# EAGLE design Solar_v1.1 (EAGLE 5.07)
DOCUMENTNUMBER: v1.0; POWER: 1/16W; TITLE: SOLAR CHARGER; TOLERANCE: 1%; VDC: 10V
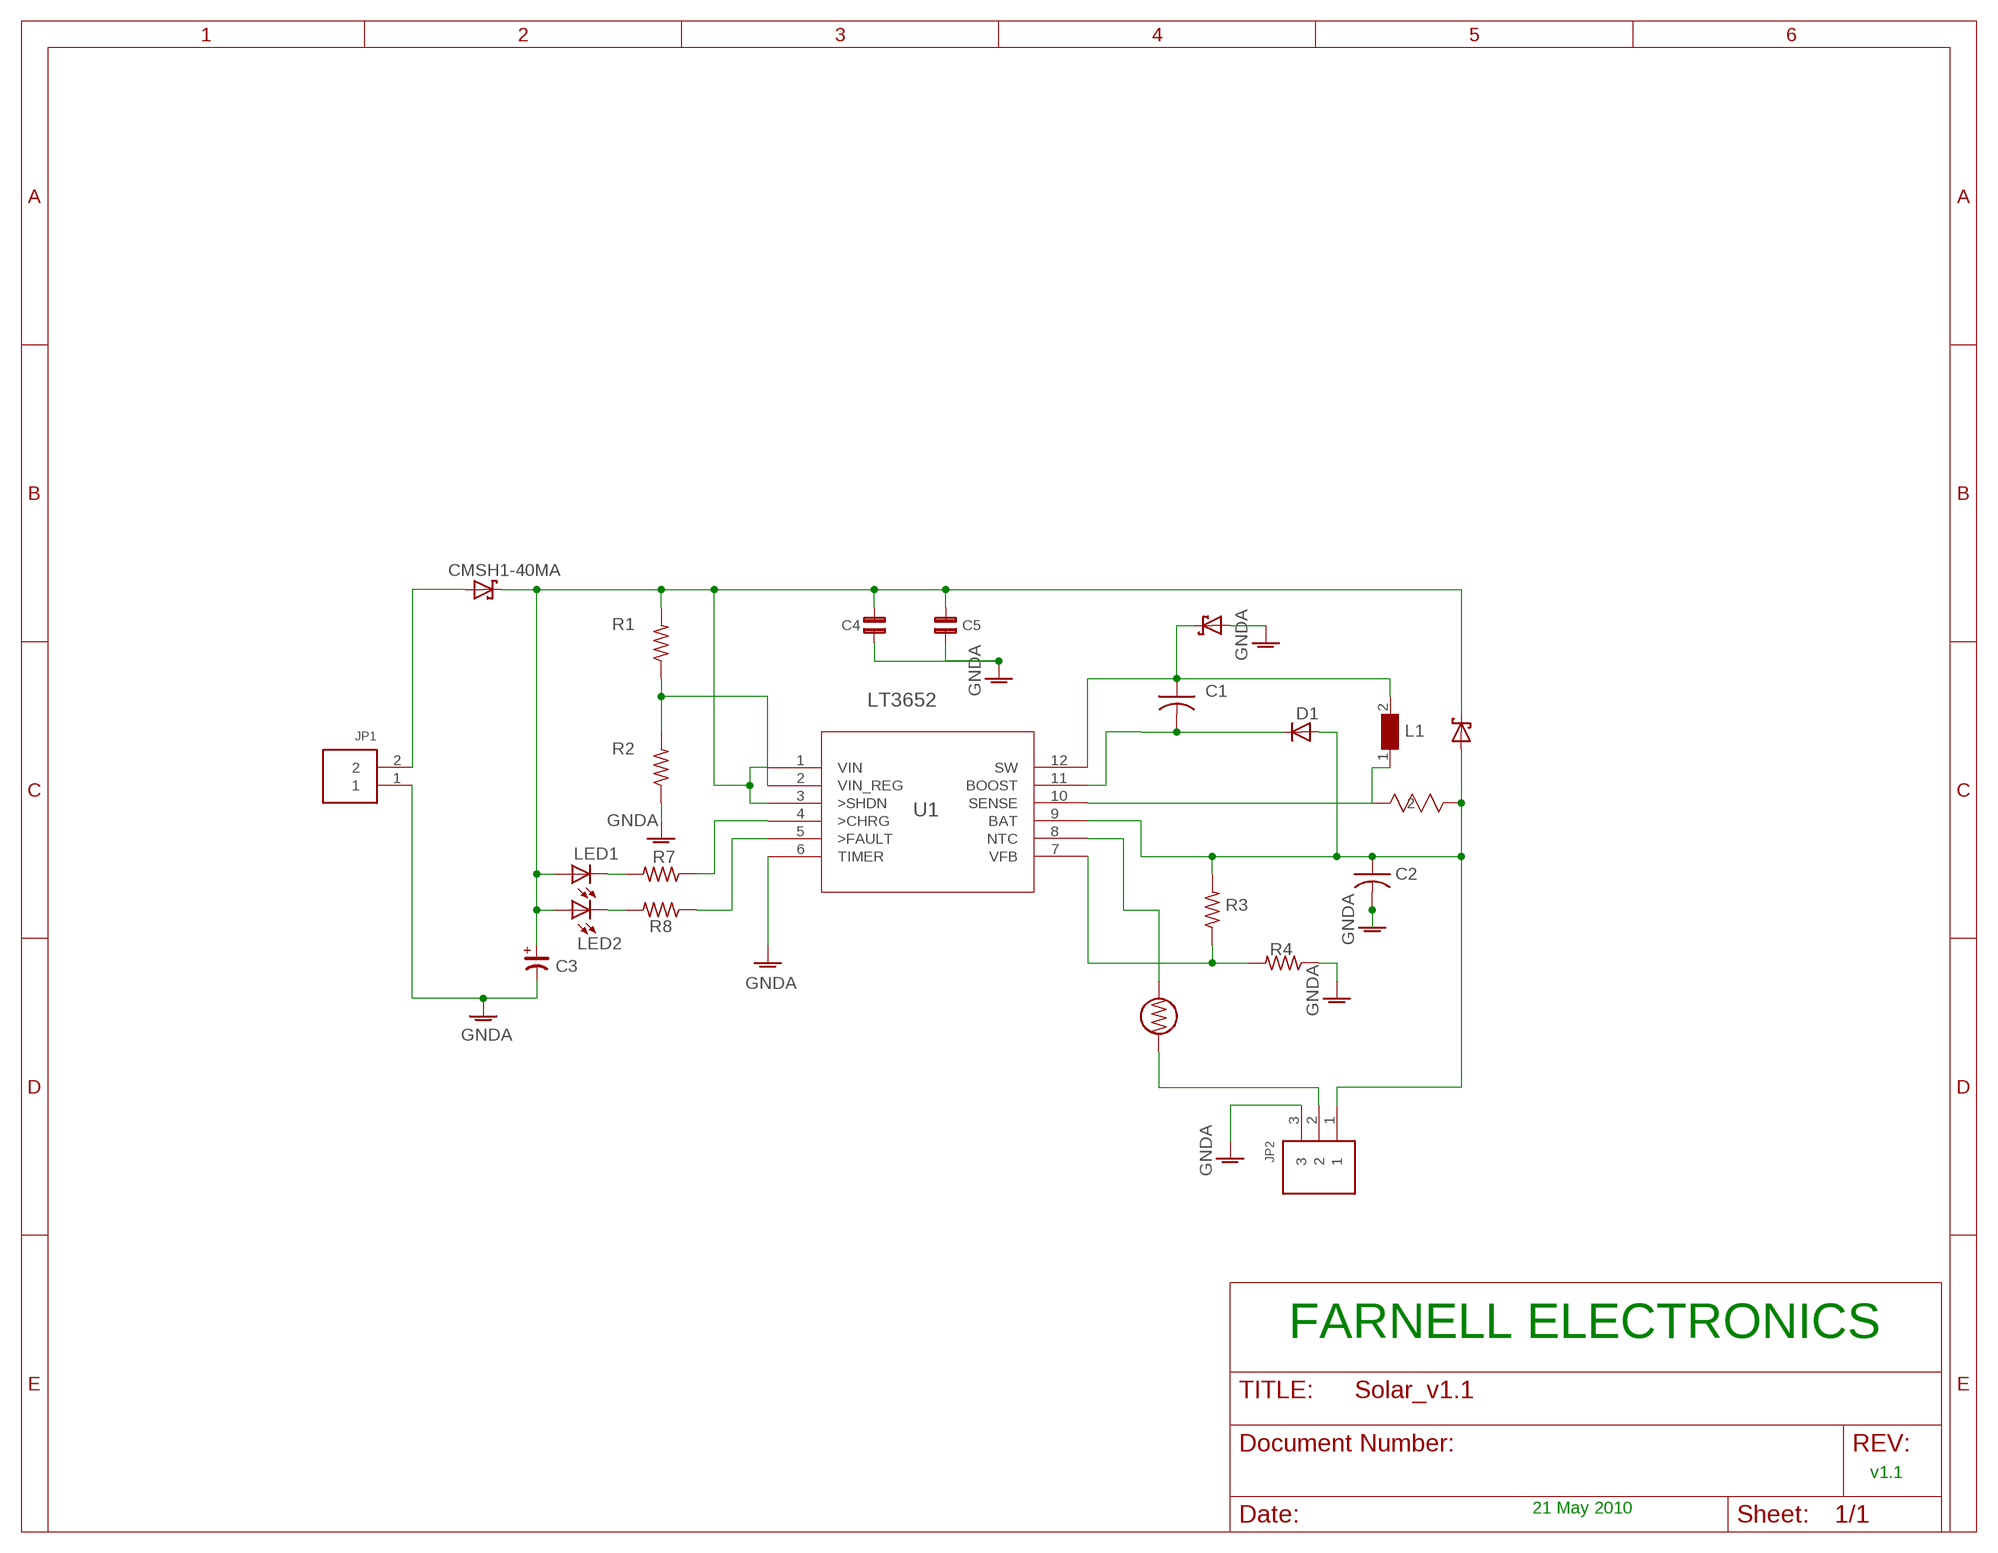
[diagram p0: schematic, sheet 1]

## Parts
C1  C-USC0805  [C0805]
C2  C-USC0805  [C0805]
C3  CP_SV-D  [CSV-D]
C4  C1210  [1210]
C5  C1210  [1210]
CMSH1-40MA  CMSH1-40MA_DEV  [SMB-DIODE]
CMSH3-40MA1  CMSH3-40MA_DEV  [SMA-DIODE]
D1  PMLL41SOD80C  [SOD80C]
DS2  CMSH3-40MA_DEV  [SMA-DIODE]
JP1  2PIN  [B2B-PH-K-S]
JP2  3PIN  [B3B-PH-K-S]
L1  WE-HCM_7443070...  [WE-HCM_7443070...]
LED1  LEDCHIPLED_1206  [CHIPLED_1206]
LED2  LEDCHIPLED_1206  [CHIPLED_1206]
R1  R-US_R0603  [R0603]
R2  R-US_R0603  [R0603]
R3  R-US_R0603  [R0603]
R4  R-US_R0603  [R0603]
R7  R-US_R0603  [R0603]
R8  R-US_R0603  [R0603]
THERMISTOR  THERMISTOR  [R0603]
U1  MSOP-12_MS  [MSOP-12_MS]
U$1  ERJ-B2BFR68V  ERJ-B1BJR68U  [RC2010N]

## Nets
GNDA: C2.2 C3.- C4.1 C5.1 DS2.A JP1.1 JP2.3 R2.1 R4.1 U1.6(TIMER)
N$1: R7.1 U1.4(>CHRG)
N$2: R1.1 R2.2 U1.2(VIN_REG)
N$3: C1.1 DS2.C L1.2 U1.12(SW)
N$4: C1.2 D1.C U1.11(BOOST)
N$6: C2.1 CMSH3-40MA1.A D1.A JP2.1 R3.2 U1.9(BAT) U$1.1
N$7: R3.1 R4.2 U1.7(VFB)
N$8: R8.1 U1.5(>FAULT)
N$9: JP2.2 THERMISTOR.1
N$10: LED1.C R7.2
N$11: LED2.C R8.2
N$12: CMSH1-40MA.A JP1.2
N$14: THERMISTOR.2 U1.8(NTC)
N$24: C3.+ C4.2 C5.2 CMSH1-40MA.C CMSH3-40MA1.C LED1.A LED2.A R1.2 U1.1(VIN) U1.3(>SHDN)
N$25: L1.1 U1.10(SENSE) U$1.2

## Notes on the sheet
- FARNELL ELECTRONICS
- v1.1
- 21 May 2010

## Library data of the parts
C1 C2 = rcl:C-US: CAPACITOR, American symbol
C3 = rc-master-smd1:CP_: POLARIZED CAP
C4 C5 = capsmd:C1210
CMSH1-40MA = CMSH3-40MA:CMSH1-40MA_DEV
CMSH3-40MA1 DS2 = CMSH3-40MA:CMSH3-40MA_DEV: CMSH3-40MA
D1 = diode:PMLL41*: High-speed diodes Source: http://www.semiconductors.philips.com/acrobat_download/datasheets/PMLL4150_2.pdf
JP1 = jst_eph:2PIN
JP2 = jst_eph:3PIN
L1 = wuerth_elektronik_eisos__v6.5:WE-HCM: Mineature High Current Power Inductor WE-HCM - Extremely low DC-resistance - Special design for low EMI-noise - Stable inductance at high DC-currents - Low temperature rise at high DC-currents - High saturation current up to 60A -- Polyphase switching regulator -- Multiphase switching regulator -- CPU / RAM power spply -- Power PC
LED1 LED2 = led:LED: LED OSRAM: - CHIPLED LG R971, LG N971, LY N971, LG Q971, LY Q971, LO R971, LY R971 LH N974, LH R974 LS Q976, LO Q976, LY Q976 LO Q996 - Hyper CHIPLED LW Q18S LB Q993, LB Q99A, LB R99A - SideLED LS A670, LO A670, LY A670, LG A670, LP A670 LB A673, LV A673, LT A673, LW A673 LH A674 LY A675 LS A676, LA A676, LO A676, LY A676, LW A676 LS A679, LY A679, LG A679 - Hyper Micro SIDELED® LS Y876, LA Y876, LO Y876, LY Y876 LT Y87S - SmartLED LW L88C, LW L88S LB L89C, LB L89S, LG L890 LS L89K, LO L89K, LY L89K LS L896, LA L896, LO L896, LY L896 - TOPLED LS T670, LO T670, LY T670, LG T670, LP T670 LSG T670, LSP T670, LSY T670, LOP T670, LYG T670 LG T671, LOG T671, LSG T671 LB T673, LV T673, LT T673, LW T673 LH T674 LS T676, LA T676, LO T676, LY T676, LB T676, LH T676, LSB T676, LW T676 LB T67C, LV T67C, LT T67C, LS T67K, LO T67K, LY T67K, LW E67C LS E67B, LA E67B, LO E67B, LY E67B, LB E67C, LV E67C, LT E67C LW T67C LS T679, LY T679, LG T679 LS T770, LO T770, LY T770, LG T770, LP T770 LB T773, LV T773, LT T773, LW T773 LH T774 LS E675, LA E675, LY E675, LS T675 LS T776, LA T776, LO T776, LY T776, LB T776 LHGB T686 LT T68C, LB T68C - Hyper Mini TOPLED® LB M676 - Mini TOPLED Santana® LG M470 LS M47K, LO M47K, LY M47K Source: http://www.osram.convergy.de LUXEON: - LUMILED® LXK2-PW12-R00, LXK2-PW12-S00, LXK2-PW14-U00, LXK2-PW14-V00 LXK2-PM12-R00, LXK2-PM12-S00, LXK2-PM14-U00 LXK2-PE12-Q00, LXK2-PE12-R00, LXK2-PE12-S00, LXK2-PE14-T00, LXK2-PE14-U00 LXK2-PB12-K00, LXK2-PB12-L00, LXK2-PB12-M00, LXK2-PB14-N00, LXK2-PB14-P00, LXK2-PB14-Q00 LXK2-PR12-L00, LXK2-PR12-M00, LXK2-PR14-Q00, LXK2-PR14-R00 LXK2-PD12-Q00, LXK2-PD12-R00, LXK2-PD12-S00 LXK2-PH12-R00, LXK2-PH12-S00 LXK2-PL12-P00, LXK2-PL12-Q00, LXK2-PL12-R00 Source: www.luxeon.com KINGBRIGHT: KA-3528ASYC Source: www.kingbright.com
R1-R4 R7 R8 = resistor:R-US_: RESISTOR, American symbol
THERMISTOR = Thermistor:THERMISTOR
U1 = LT3652:MSOP-12_MS
U$1 = ERJ:ERJ-B1BJR68U

## Board
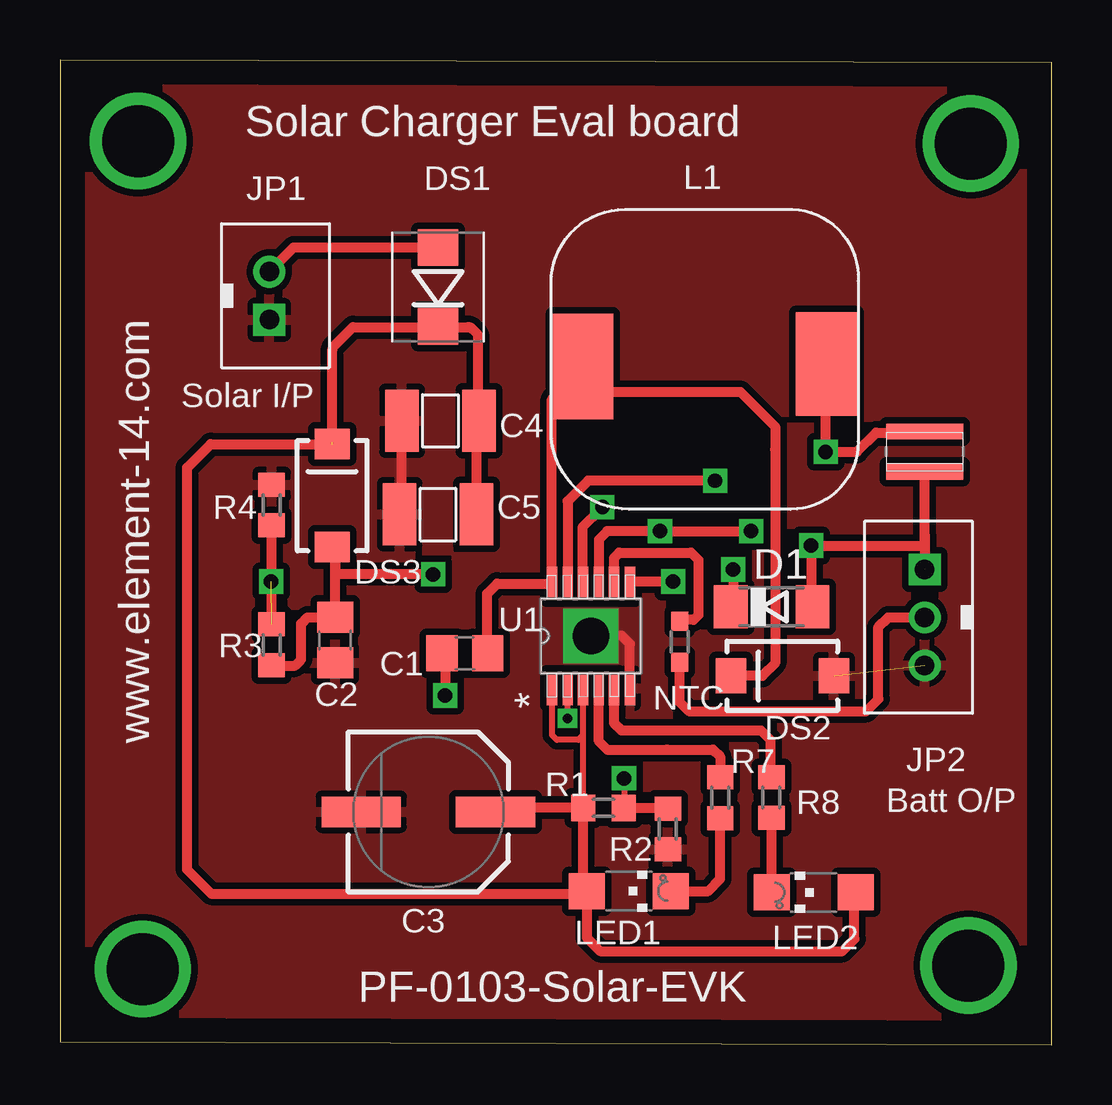
[diagram p1: board, top side]
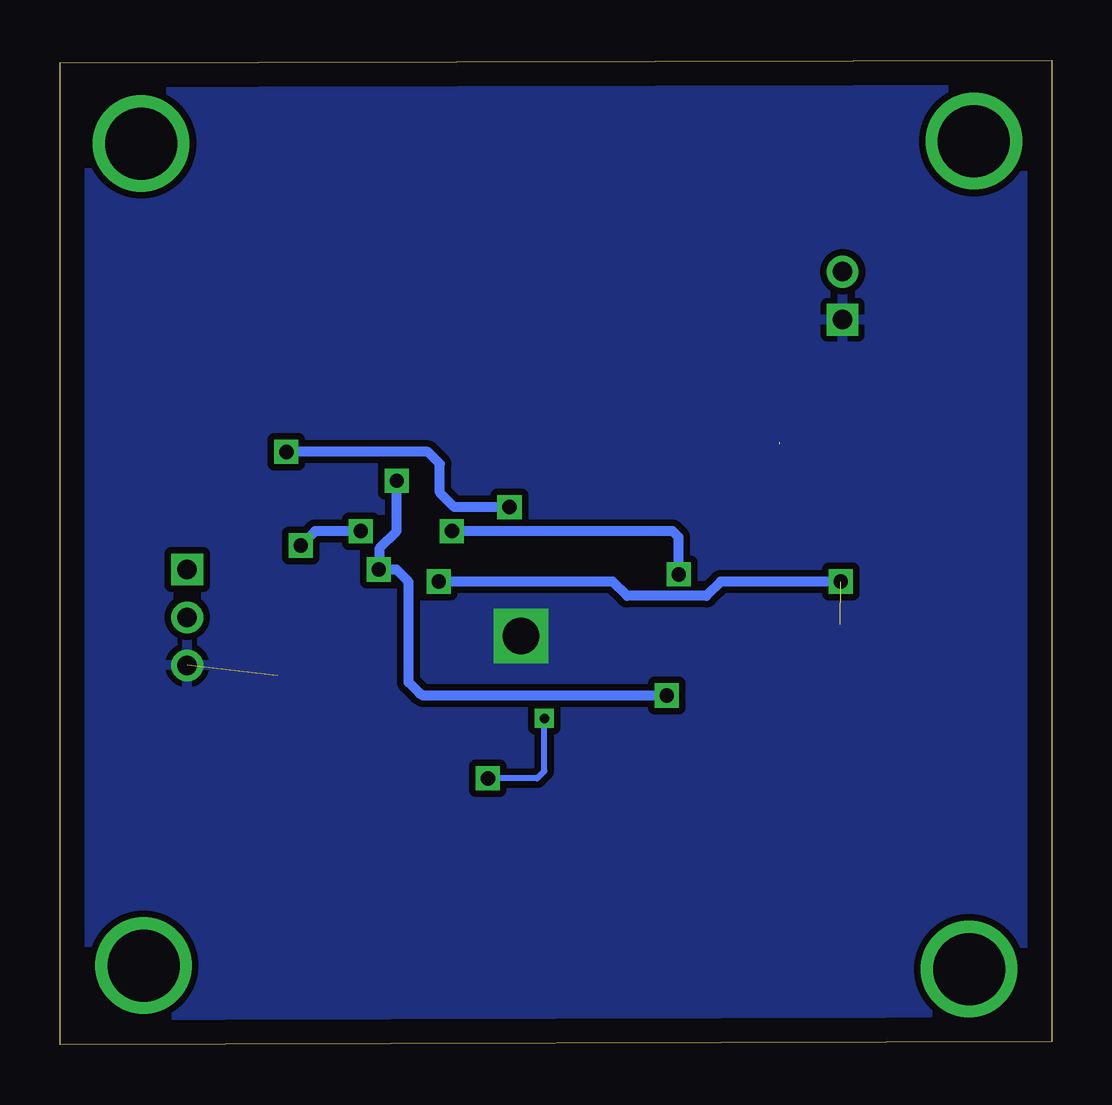
[diagram p2: board, bottom side, seen from below]

Size 41.33 x 41.03 mm. Coordinates in mm from the lower left corner, seen from the top.
Outline: 0,0.12 41.33,0 41.33,40.91 0,41.03 0,0.12
Copper layers (1*16): Top 0.035mm / dielectric 1.5mm / Bottom 0.035mm
Design rules "default": minimum track width 10mil, minimum drill 24mil, track to track 8mil, track to pad 8mil, pad to pad 8mil, via to via 8mil, smd to smd 8mil, copper to edge 40mil, drill to drill 8mil, minimum pad ring 10mil, minimum via ring 8mil, stop-mask expansion 4mil, vias tented up to drill 0mil, thermal gap 10mil

### Footprints (pad centres in the part's own frame; a part is rotated, then mirrored left to right if it is on the bottom)
C0805 = smd 1.3 x 1.5: 1 -0.95,0; 2 0.95,0
CSV-D = smd 3.302 x 1.27: + -2.794,0; - 2.794,0
1210 = smd 1.397 x 2.591: 1 -1.6,0; 2 1.6,0
SMB-DIODE = smd 1.52 x 1.68: A 1.65,0; C -1.65,0
SMA-DIODE = smd 1.27 x 1.47: A -2.15,0; C 2.15,0
SOD80C = smd 1.4 x 1.8: A 1.7,0; C -1.7,0
B2B-PH-K-S = drill 0.813 square: 1 2,0 | drill 0.813 round: 2 0,0
B3B-PH-K-S = drill 0.813 square: 1 2,0 | drill 0.813 round: 2 0,0; 3 -2,0
WE-HCM_7443070... = smd 2.55 x 2.2: 1 -5.075,1.3; 2 5.075,1.45; 3 -5.075,-0.8; 4 5.075,-0.75
CHIPLED_1206 = smd 1.5 x 1.5: A 0,-1.75; C 0,1.75
R0603 = smd 1 x 1.1: 1 -0.85,0; 2 0.85,0
R0603' = smd 0.8 x 0.7: 1 -0.85,0; 2 0.85,0
MSOP-12_MS = smd 1.397 x 0.432: 1 -2.184,1.626; 2 -2.184,0.965; 3 -2.184,0.33; 4 -2.184,-0.33; 5 -2.184,-0.965; 6 -2.184,-1.626; 7 2.184,-1.626; 8 2.184,-0.965; 9 2.184,-0.33; 10 2.184,0.33; 11 2.184,0.965; 12 2.184,1.626
RC2010N = smd 0.66 x 3.2: 1 -0.838,0; 2 0.838,0

### Placement (x,y rotation side)
C1  16.87,16.31 180 top
C2  11.46,16.86 270 top
C3  15.35,9.7 180 top
C4  15.85,26 0 top
C5  15.75,22.1 0 top
CMSH1-40MA  15.75,31.57 90 top
CMSH3-40MA1  11.34,22.88 90 top
D1  29.65,18.25 0 top
DS2  30.1,15.37 180 top
JP1  8.72,32.21 270 top
JP2  36.03,17.8 90 top
L1  26.86,28.61 180 top
LED1  23.7,6.4 270 top
LED2  31.4,6.35 90 top
R1  22.65,9.87 180 top
R2  25.33,8.99 90 top
R3  8.82,16.66 270 top
R4  8.82,22.49 270 top
R7  27.51,10.29 270 top
R8  29.64,10.3 270 top
THERMISTOR  [R0603']  25.82,16.79 90 top
U1  22.12,17.03 90 top
U$1  36.03,24.71 90 top

### Tracks (layer width: path | path; a pad name or v marks a point on that pad's centre or on a via)
GNDA  (via drill 1.52)  (1 unrouted)
  Top 0.406: U1.6 23.75,16.7 23.4,17.05 22.1,17.05 | C4.1 14.25,22.2 C5.1
  other vias: 22.12,17.03
  pour Top (isolate 0.279): -1.17,42.12 42.01,42.12 42.01,-1.06 -1.17,-1.06
  pour Bottom (isolate 0.279): -1.17,42.12 42.01,42.12 42.01,-2.33 -1.17,-2.33
N$1
  Top 0.406: U1.4 22.45,12.65 22.8,12.3 25.3,12.3 27.2,12.3 27.5,12 R7.1
N$2  (via drill 0.4, 0.6)
  Top 0.254: U1.2 v21.16,13.6 v21.15,13.6 | v23.5,11.1 R1.1
  Top 0.406: R1.1 25.3,9.87 R2.2
  Bottom 0.254: v21.15,13.6 21.15,11.4 21.45,11.1 v23.5,11.1
N$3
  Top 0.406: C1.1 17.8,16.33 17.8,18.8 18.21,19.21 U1.12 20.49,26.89 20.95,27.35 21.59,27.35 L1.2 | L1.2 21.8,27.14 | DS2.C 29.27,15.37 29.8,15.9 29.8,24.8 29.8,25.75 28.35,27.2 21.83,27.2 L1.2
N$4  (via drill 0.6)
  Top 0.406: C1.2 16.05,16.18 v16.05,14.55 | D1.C 28.05,18.25 v28.05,19.8 | U1.11 21.16,22.66 22,23.5 v27.3,23.5
  Bottom 0.406: v28.05,19.8 27.95,19.7 | v27.3,23.5 27.3,21.4 28,20.7 28,19.85 v28.05,19.8 | v16.05,14.55 26.12,14.55 arc45 26.34,14.64 26.8,15.1 26.8,19.17 arc-45 26.89,19.39 27.3,19.8 v28.05,19.8
N$6  (via drill 0.6)  (1 unrouted)
  Top 0: 11.55,19.55 15.55,19.55 v15.55,19.6
  Top 0.406: 22.45,21.05 U1.9 22.45,21.05 | 22.8,21.4 22.45,21.05 | v25,21.4 22.8,21.4 | 22.8,21.4 22.45,21.05 | v25,21.4 22.8,21.4 | v25,21.4 v28.8,21.4 | 31.44,18.16 D1.A 31.3,18.3 v31.3,20.8 35.93,20.8 36.03,20.9 36.03,21.27 | 36.03,21.27 U$1.1 | 11.46,20.48 C2.1 10.31,17.81 10.05,17.55 10.05,16.05 9.8,15.8 R3.2 | 11.46,20.48 arc45 11.37,20.7 CMSH3-40MA1.A | 11.46,20.48 11.46,19.77 arc45 11.55,19.55 | v15.55,19.6 11.5,19.6 11.45,19.55 | 36.03,21.27 JP2.1
  Bottom 0.406: v25,21.4 16.8,21.4 15.8,21.4 15.55,21.15 v15.55,19.6 | v28.8,21.4 30.7,21.4 v31.3,20.8
N$7  (via drill 0.6)  (1 unrouted)
  Top 0.406: v25.55,19.3 23.83,19.3 U1.7 | R3.1 R4.2
  Bottom 0.406: v25.55,19.3 18.3,19.3 17.7,18.7 14.4,18.7 13.8,19.3 v8.8,19.3
N$8
  Top 0.406: U1.5 23.08,13.41 23.1,13.4 23.4,13.1 27.5,13.1 29.2,13.1 29.6,12.7 29.6,11.19 R8.1
N$9
  Top 0.406: THERMISTOR.1 25.82,14.28 26.2,13.9 33.6,13.9 34.1,14.4 34.1,17.4 34.5,17.8 JP2.2
N$10
  Top 0.406: R7.2 27.51,6.91 27,6.4 LED1.C
N$11
  Top 0.406: LED2.C R8.2
N$12
  Top 0.406: JP1.2 9.73,33.22 CMSH1-40MA.A
N$14
  Top 0.406: U1.8 23.08,20.28 23.3,20.5 26.3,20.5 26.6,20.2 26.6,17.9 26.4,17.7 25.88,17.7 THERMISTOR.2
N$16  (via drill 3)
  other vias: 37.95,37.55
N$18  (via drill 3)
  other vias: 3.25,37.65
N$19  (via drill 3)
  other vias: 3.45,3.15
N$20  (via drill 3)
  other vias: 37.85,3.3
N$24  (1 unrouted)
  Top 0.254: U1.1 20.5,12.9 20.7,12.7 21.6,12.7 21.79,12.89 U1.3 21.8,14.83 R1.2
  Top 0.406: R1.2 21.8,10.07 | C3.+ 18.14,9.87 R1.2 | R1.2 21.8,7.05 LED1.A | 11.24,25 arc90 11.34,25.1 | 21.72,6.8 arc45 21.94,6.89 LED1.A | C5.2 17.35,25.77 arc-45 C4.2 C4.2 arc-45 17.4,26.12 17.4,29.6 17.17,29.83 arc45 17,29.9 15.8,29.9 arc-45 CMSH1-40MA.C arc-45 15.7,29.9 12.2,29.9 11.43,29.13 arc45 11.34,28.91 CMSH3-40MA1.C 6.28,25.03 5.3,24.05 5.3,7.3 6.3,6.3 21.85,6.3 LED1.A | LED1.A 21.95,4.45 22.5,3.9 32.6,3.9 33.1,4.4 33.1,6.3 LED2.A
N$25  (via drill 0.6)
  Top 0.406: U1.10 21.79,21.59 22.5,22.3 v22.6,22.4 | L1.1 31.9,27.27 v31.9,24.7 33.2,24.7 34,25.5 36.08,25.5 U$1.2
  Bottom 0.406: v22.6,22.4 24.9,22.4 25.5,23 25.5,24.2 26,24.7 v31.9,24.7

### Text on the board
tNames: Solar Charger Eval board | JP1 | DS1 | www.element-14.com | Solar I/P | DS3 | U1 | NTC | JP2 | Batt O/P | PF-0103-Solar-EVK